# EAGLE design ltc3886circuit_rev1 (EAGLE 9.3.0)
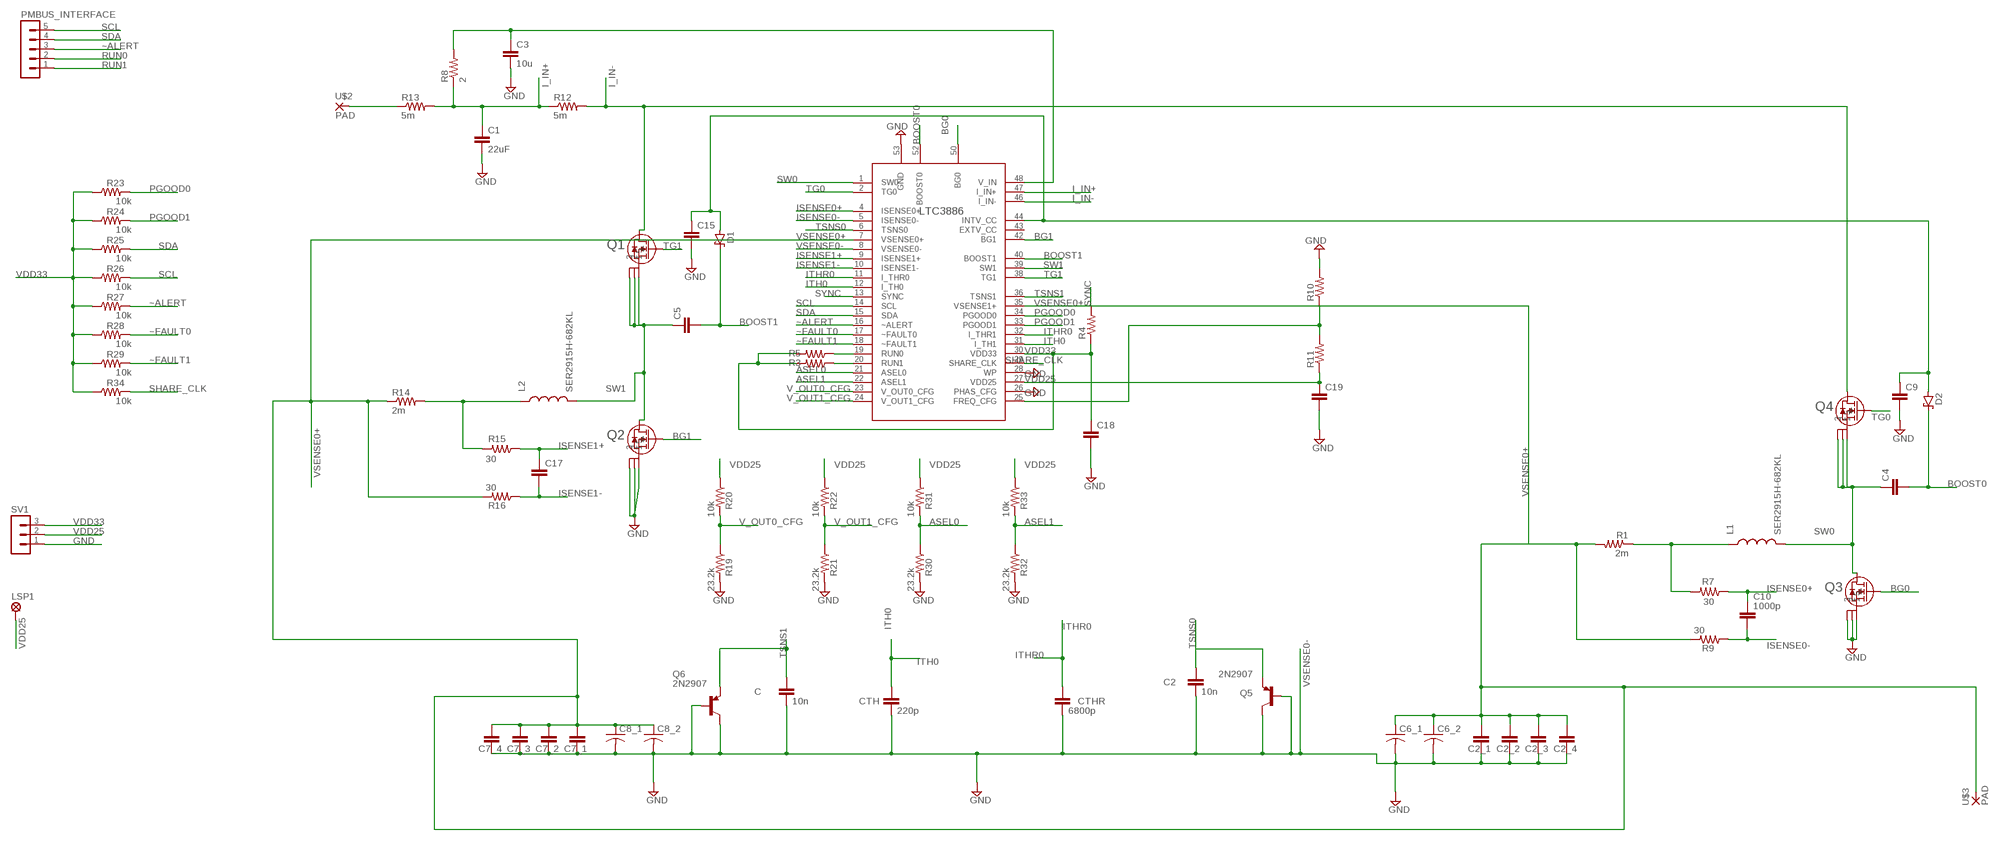
[diagram p0: schematic, sheet 1]

## Parts
C  10n  C-EU075-032X103  [C075-032X103]
C1  22uF  ESK226M100AE3AA(22UF_CAP)  [ESK226M100AE3AA(22UF_CAP)]
C2  10n  C-EU075-032X103  [C075-032X103]
C2_1  ESK226M100AE3AA(22UF_CAP)  [ESK226M100AE3AA(22UF_CAP)]
C2_2  ESK226M100AE3AA(22UF_CAP)  [ESK226M100AE3AA(22UF_CAP)]
C2_3  ESK226M100AE3AA(22UF_CAP)  [ESK226M100AE3AA(22UF_CAP)]
C2_4  ESK226M100AE3AA(22UF_CAP)  [ESK226M100AE3AA(22UF_CAP)]
C3  10u  C-EU075-032X103  [C075-032X103]
C4  C-EU075-032X103  [C075-032X103]
C5  C-EU075-032X103  [C075-032X103]
C6_1  C-US050-025X075  [C050-025X075]
C6_2  C-US050-025X075  [C050-025X075]
C7_1  ESK226M100AE3AA(22UF_CAP)  [ESK226M100AE3AA(22UF_CAP)]
C7_2  ESK226M100AE3AA(22UF_CAP)  [ESK226M100AE3AA(22UF_CAP)]
C7_3  ESK226M100AE3AA(22UF_CAP)  [ESK226M100AE3AA(22UF_CAP)]
C7_4  ESK226M100AE3AA(22UF_CAP)  [ESK226M100AE3AA(22UF_CAP)]
C8_1  C-US050-025X075  [C050-025X075]
C8_2  C-US050-025X075  [C050-025X075]
C9  C-EU075-032X103  [C075-032X103]
C10  1000p  C-EU075-032X103  [C075-032X103]
C15  C-EU075-032X103  [C075-032X103]
C17  C-EU075-032X103  [C075-032X103]
C18  C-EU075-032X103  [C075-032X103]
C19  C-EU075-032X103  [C075-032X103]
CTH  220p  C-EU075-032X103  [C075-032X103]
CTHR  6800p  C-EU075-032X103  [C075-032X103]
D1  SCHOTTKY-DIODECB417-15  [CB417-15]
D2  SCHOTTKY-DIODECB417-15  [CB417-15]
L1  SER2915H-682KL  [SER2915H-682KL]
L2  SER2915H-682KL  [SER2915H-682KL]
LSP1  MCS08  [MCS08]
PMBUS_INTERFACE  MA05-1  [MA05-1]
Q1  RJK0651DPB-00J5  [LFPAK]
Q2  RJK0651DPB-00J5  [LFPAK]
Q3  RJK0651DPB-00J5  [LFPAK]
Q4  RJK0651DPB-00J5  [LFPAK]
Q5  2N2907  [TO18]
Q6  2N2907  [TO18]
R1  2m  CSS2H-2512K-2L00FE  [CSS2H-2512K-2L00FE]
R3  R-US_0207/12  [0207/12]
R4  R-US_0207/12  [0207/12]
R5  R-US_0207/12  [0207/12]
R7  30  R-US_0207/12  [0207/12]
R8  2  ERJ-B1BF2R0U(2-OHM)  [ERJ-B1BF2R0U(2-OHM)]
R9  30  R-US_0207/12  [0207/12]
R10  R-US_0207/12  [0207/12]
R11  R-US_0207/12  [0207/12]
R12  5m  CSS4J-4026K-5L00F(5M-OHM)  [CSS4J-4026K-5L00F(5M-OHM)]
R13  5m  CSS2H-2512K-2L00FE  [CSS2H-2512K-2L00FE]
R14  2m  CSS2H-2512K-2L00FE  [CSS2H-2512K-2L00FE]
R15  30  R-US_0207/12  [0207/12]
R16  30  R-US_0207/12  [0207/12]
R19  23.2k  R-US_0207/12  [0207/12]
R20  10k  R-US_0207/12  [0207/12]
R21  23.2k  R-US_0207/12  [0207/12]
R22  10k  R-US_0207/12  [0207/12]
R23  10k  R-US_0207/12  [0207/12]
R24  10k  R-US_0207/12  [0207/12]
R25  10k  R-US_0207/12  [0207/12]
R26  10k  R-US_0207/12  [0207/12]
R27  10k  R-US_0207/12  [0207/12]
R28  10k  R-US_0207/12  [0207/12]
R29  10k  R-US_0207/12  [0207/12]
R30  23.2k  R-US_0207/12  [0207/12]
R31  10k  R-US_0207/12  [0207/12]
R32  23.2k  R-US_0207/12  [0207/12]
R33  10k  R-US_0207/12  [0207/12]
R34  10k  R-US_0207/12  [0207/12]
SV1  MA03-1  [MA03-1]
U$1  LTC3886  [QFN-52_UKG_2]
U$2  PAD  [PAD]
U$3  PAD  [PAD]

## Nets
ASEL0: R30.1 R31.2 U$1.21(ASEL0)
ASEL1: R32.1 R33.2 U$1.22(ASEL1)
BG0: Q3.4 U$1.50(BG0)
BG1: Q2.4 U$1.42(BG1)
BOOST0: C4.2 D2.C U$1.52(BOOST0)
BOOST1: C5.2 D1.C U$1.40(BOOST1)
GND: C1.P$2 C3.2 C9.2 C15.2 C18.2 C19.2 Q2.1 Q2.2 Q2.3 Q3.1 Q3.2 Q3.3 R10.2 R19.2 R21.2 R30.2 R32.2 SV1.1 U$1.26(PHAS_CFG) U$1.28(WP) U$1.53(GND)
I_IN+: C1.P$1 R8.P$1 R12.P$1 R13.P$2 U$1.47(I_IN+)
I_IN-: Q1.5 Q4.5 R12.P$2 U$1.46(I_IN-)
ISENSE0+: C10.1 R7.1 U$1.4(ISENSE0+)
ISENSE0-: C10.2 R9.1 U$1.5(ISENSE0-)
ISENSE1+: C17.1 R15.1 U$1.9(ISENSE1+)
ISENSE1-: C17.2 R16.1 U$1.10(ISENSE1-)
ITH0: CTH.1 U$1.12(I_TH0) U$1.31(I_TH1)
ITHR0: CTHR.1 U$1.11(I_THR0) U$1.32(I_THR1)
N$2: R5.1 U$1.19(RUN0)
N$3: R3.1 U$1.20(RUN1)
N$4: L2.P$1 R14.P$2 R15.2
N$5: C9.1 C15.1 D1.A D2.A U$1.44(INTV_CC)
N$8: L1.P$1 R1.P$1 R7.2
N$17: R13.P$1 U$2.P$1(P)
N$19: C3.1 R8.P$2 U$1.48(V_IN)
N$24: R10.1 R11.2 U$1.25(FREQ_CFG)
PGOOD0: R23.2 U$1.34(PGOOD0)
PGOOD1: R24.2 U$1.33(PGOOD1)
RUN0: PMBUS_INTERFACE.2
RUN1: PMBUS_INTERFACE.1
SCL: PMBUS_INTERFACE.5 R26.2 U$1.14(SCL)
SDA: PMBUS_INTERFACE.4 R25.2 U$1.15(SDA)
SHARE_CLK: R34.2 U$1.29(SHARE_CLK)
SW0: C4.1 L1.P$2 Q3.5 Q4.1 Q4.2 Q4.3 U$1.1(SW0)
SW1: C5.1 L2.P$2 Q1.1 Q1.2 Q1.3 Q2.5 U$1.39(SW1)
SYNC: R4.2 U$1.13(SYNC)
TG0: Q4.4 U$1.2(TG0)
TG1: Q1.4 U$1.38(TG1)
TSNS0: C2.1 Q5.1(E) U$1.6(TSNS0)
TSNS1: C.1 Q6.1(E) U$1.36(TSNS1)
V_OUT0_CFG: R19.1 R20.2 U$1.23(V_OUT0_CFG)
V_OUT1_CFG: R21.1 R22.2 U$1.24(V_OUT1_CFG)
VDD25: C19.1 LSP1.MP R11.1 R20.1 R22.1 R31.1 R33.1 SV1.2 U$1.27(VDD25)
VDD33: C18.1 R3.2 R4.1 R5.2 R23.1 R24.1 R25.1 R26.1 R27.1 R28.1 R29.1 R34.1 SV1.3 U$1.30(VDD33)
VSENSE0+: C2_1.P$1 C2_2.P$1 C2_3.P$1 C2_4.P$1 C6_1.1 C6_2.1 C7_1.P$1 C7_2.P$1 C7_3.P$1 C7_4.P$1 C8_1.1 C8_2.1 R1.P$2 R9.2 R14.P$1 R16.2 U$1.7(VSENSE0+) U$1.35(VSENSE1+) U$3.P$1(P)
VSENSE0-: C2.2 C2_1.P$2 C2_2.P$2 C2_3.P$2 C2_4.P$2 C6_1.2 C6_2.2 C7_1.P$2 C7_2.P$2 C7_3.P$2 C7_4.P$2 C8_1.2 C8_2.2 C.2 CTH.2 CTHR.2 Q5.2(B) Q5.3(C) Q6.2(B) Q6.3(C) U$1.8(VSENSE0-) ; supply symbol labelled GND
~ALERT: PMBUS_INTERFACE.3 R27.2 U$1.16(~ALERT)
~FAULT0: R28.2 U$1.17(~FAULT0)
~FAULT1: R29.2 U$1.18(~FAULT1)
Unconnected: U$1.43(EXTV_CC)

## Library data of the parts
C C2-C5 C9 C10 C15 C17-C19 CTH CTHR = rcl:C-EU: CAPACITOR, European symbol; SPICEPREFIX: C
C1 C2_1-C2_4 C7_1-C7_4 = power_subsystem_components:ESK226M100AE3AA(22UF_CAP)
C6_1 C6_2 C8_1 C8_2 = rcl:C-US: CAPACITOR, American symbol; SPICEPREFIX: C
D1 D2 = diode:SCHOTTKY-DIODE: Schottky Diode
L1 L2 = power_subsystem_components:SER2915H-682KL
LSP1 = solpad:MCS08: SOLDER PAD MC S0,8, drill 1.2 mm, distributor Buerklin, 08F130
PMBUS_INTERFACE = con-lstb:MA05-1: PIN HEADER; OC_FARNELL: unknown; OC_NEWARK: unknown
Q1-Q4 = SamacSys_Parts:RJK0651DPB-00J5; MANUFACTURER_PART_NUMBER: RJK0651DPB00#J5; VENDOR: Renesas Electronics
Q5 Q6 = transistor-pnp:2N2907*: PNP Transistor
R1 R13 R14 = power_subsystem_components:CSS2H-2512K-2L00FE
R3-R5 R7 R9-R11 R15 R16 R19-R34 = rcl:R-US_: RESISTOR, American symbol; SPICEPREFIX: R
R8 = power_subsystem_components:ERJ-B1BF2R0U(2-OHM)
R12 = power_subsystem_components:CSS4J-4026K-5L00F(5M-OHM)
SV1 = con-lstb:MA03-1: PIN HEADER; OC_FARNELL: unknown; OC_NEWARK: unknown
U$1 = ltc3886:LTC3886
U$2 U$3 = power_subsystem_components:PAD

## Board
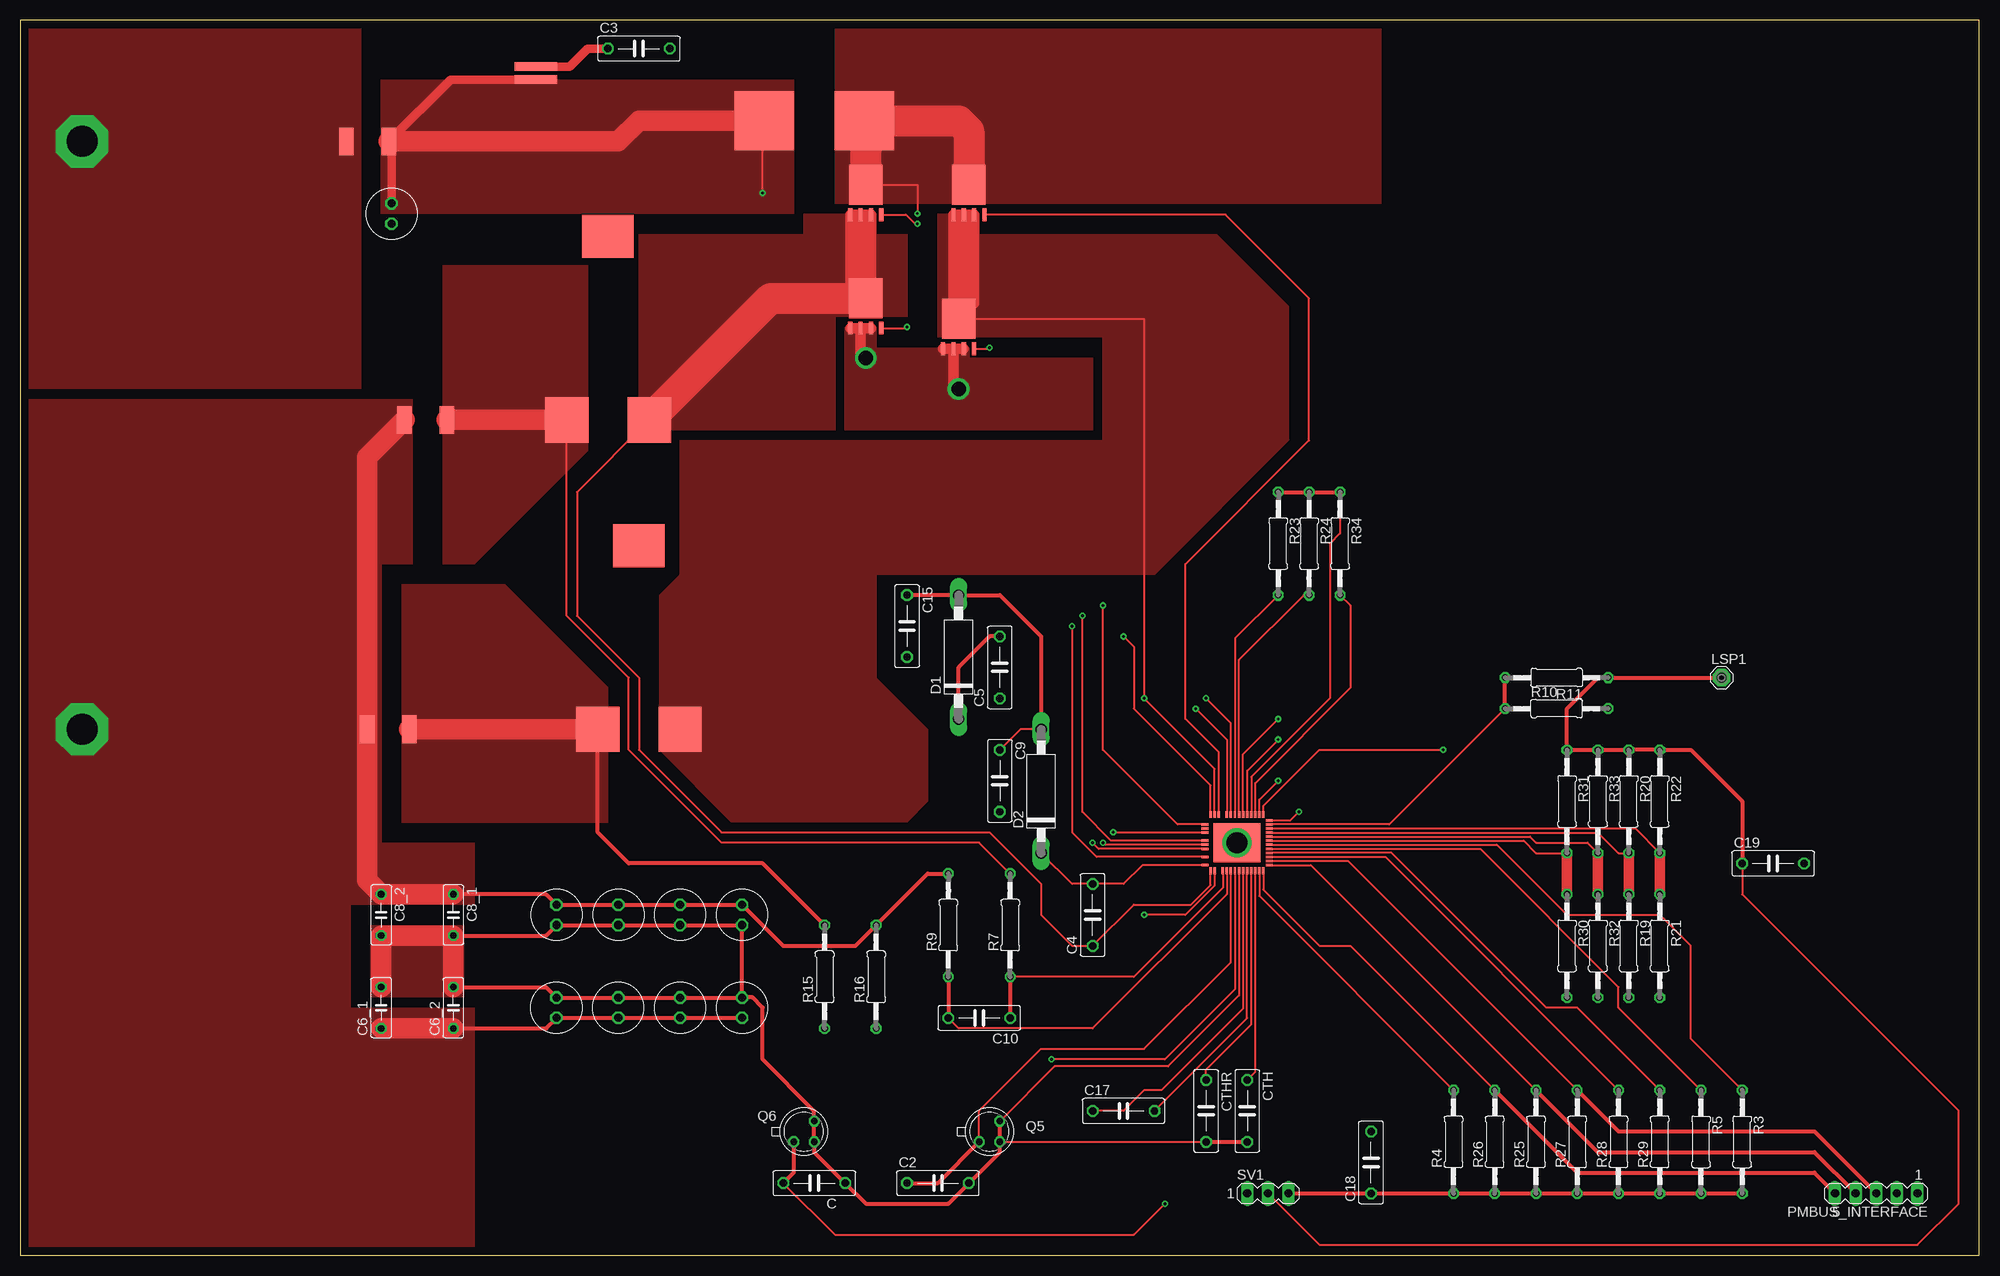
[diagram p1: board, top side]
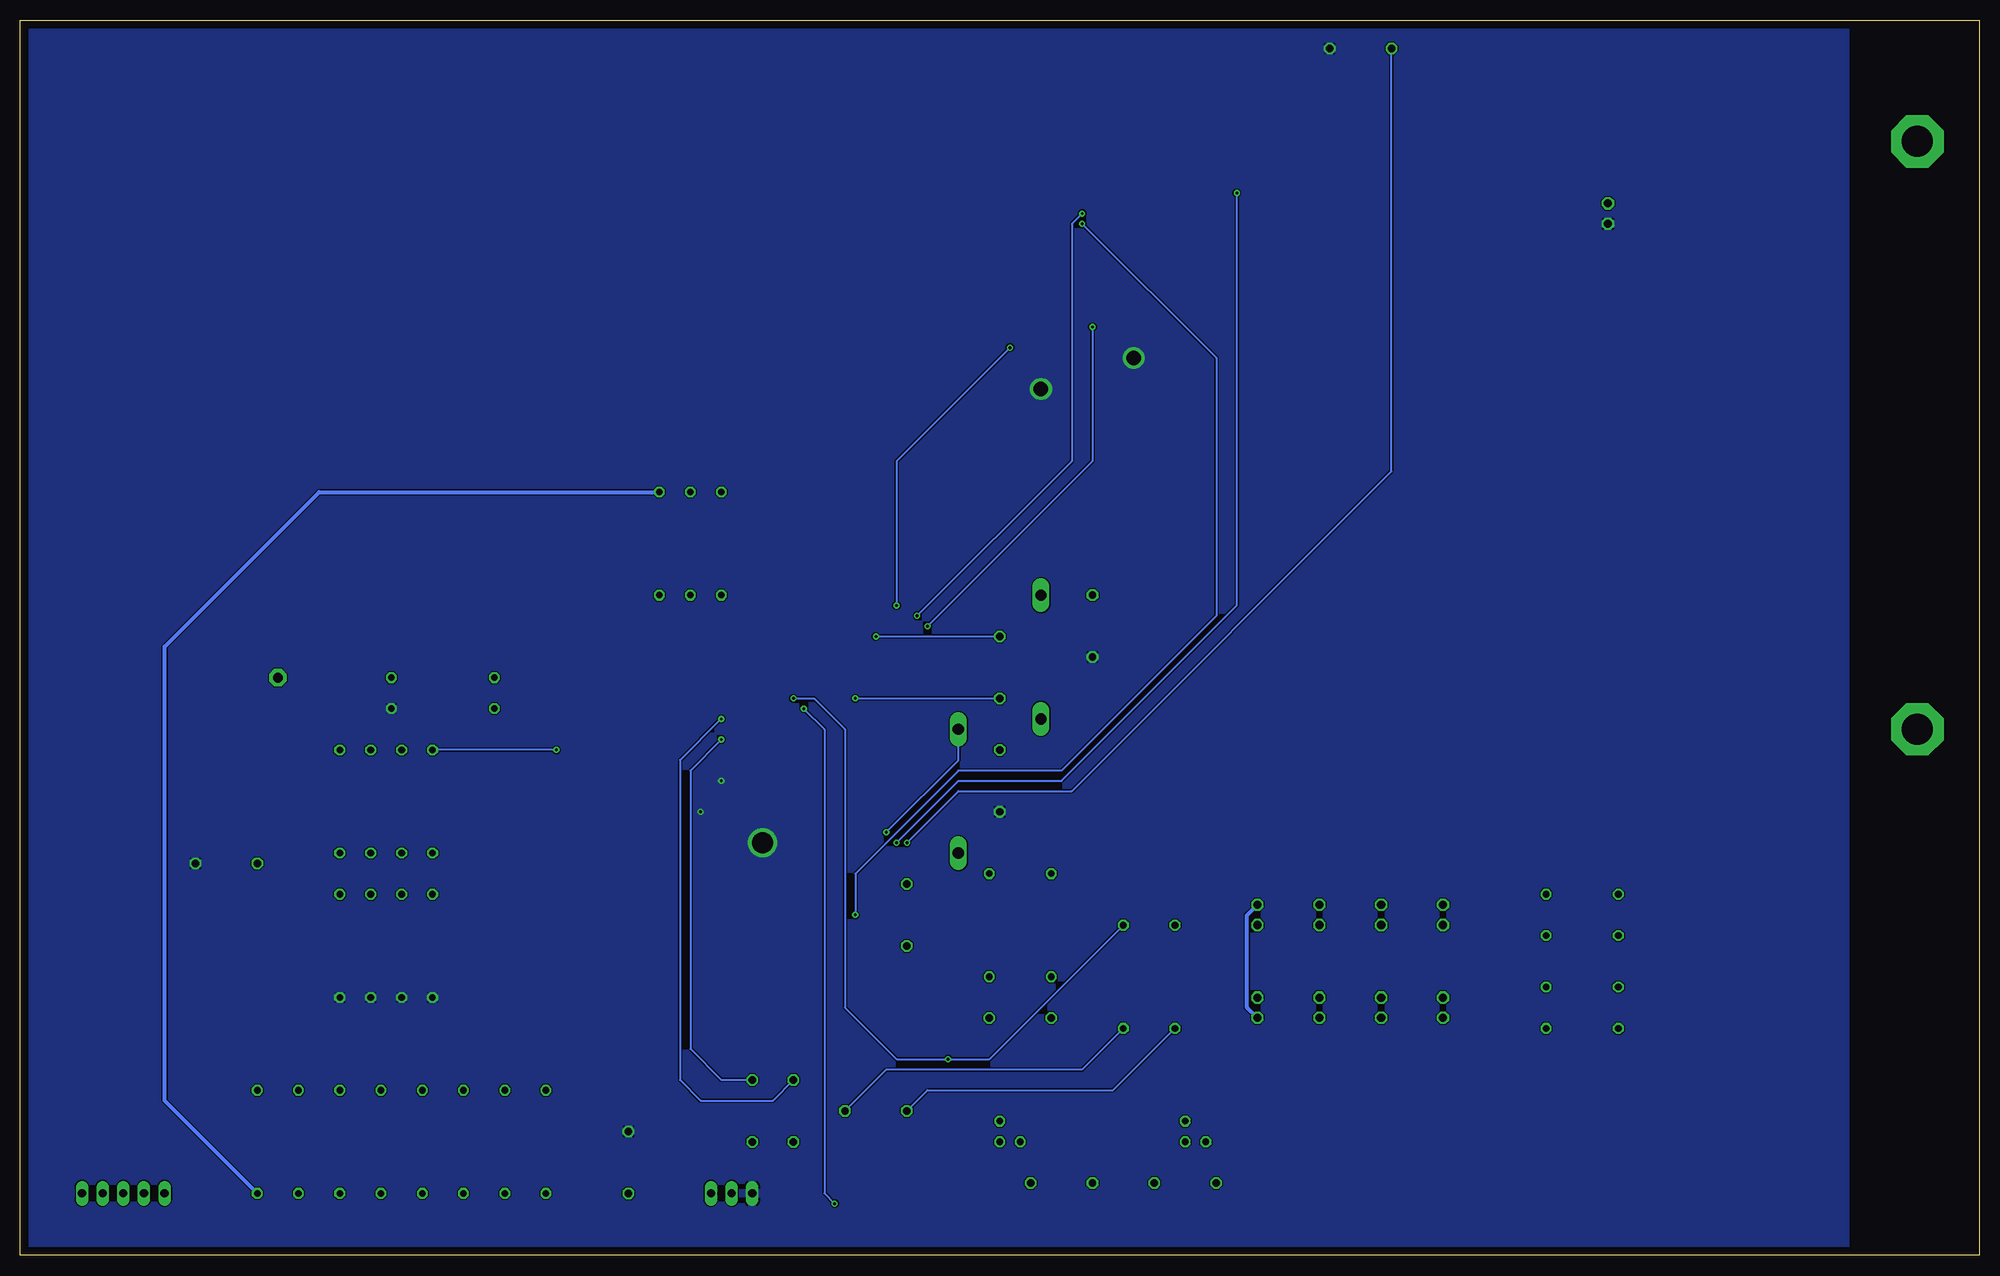
[diagram p2: board, bottom side, seen from below]

Size 241.28 x 152.07 mm. Coordinates in mm from the lower left corner, seen from the top.
Outline: 0,0 241.28,0 241.28,152.07 0,152.07 0,0
Copper layers (1*16): Top 0.035mm / dielectric 1.5mm / Bottom 0.035mm
Design rules "default": minimum track width 6mil, minimum drill 0.35mm, track to track 6mil, track to pad 6mil, pad to pad 6mil, via to via 6mil, smd to smd 6mil, copper to edge 40mil, drill to drill 6mil, minimum pad ring 10mil, minimum via ring 8mil, stop-mask expansion 4mil, vias tented up to drill 0mil, thermal gap 10mil

### Footprints (pad centres in the part's own frame; a part is rotated, then mirrored left to right if it is on the bottom)
C075-032X103 = drill 0.914 octagon: 1 -3.81,0; 2 3.81,0
ESK226M100AE3AA(22UF_CAP) = drill 1 octagon: P$1 -1.25,0; P$2 1.25,0
C050-025X075 = drill 0.813 octagon: 1 -2.54,0; 2 2.54,0
CB417-15 = drill 1.397 long: A 7.62,0; C -7.62,0
SER2915H-682KL = smd 5.33 x 5.59: P$1 -5.075,0; P$2 5.075,0 | smd 6.35 x 5.28: P$3 0,22.6
MCS08 = drill 1.194 pad 2.159 octagon: MP 0,0
MA05-1 = drill 1.016 long: 1 -5.08,0; 2 -2.54,0; 3 0,0; 4 2.54,0; 5 5.08,0
LFPAK = smd 1.549 x 0.508: 1 -2.68,1.905; 2 -2.68,0.635; 3 -2.68,-0.635; 4 -2.68,-1.905 | smd 4.902 x 4.14: 5 1.003,0
TO18 = drill 0.813 octagon: 1 -1.27,-1.27; 2 1.27,-1.27; 3 1.27,1.27
CSS2H-2512K-2L00FE = smd 1.8 x 3.4: P$1 -3,0; P$2 2.2,0
0207/12 = drill 0.813 octagon: 1 -6.35,0; 2 6.35,0
ERJ-B1BF2R0U(2-OHM) = smd 1.1 x 5.2: P$1 0,0; P$2 1.6,0
CSS4J-4026K-5L00F(5M-OHM) = smd 7.3 x 7.3: P$1 -6.15,0; P$2 6.15,0
MA03-1 = drill 1.016 long: 1 -2.54,0; 2 0,0; 3 2.54,0
QFN-52_UKG_2 = smd 0.813 x 0.305: 1 -3.454,3.25; 2 -3.454,2.75; 4 -3.454,1.75; 5 -3.454,1.25; 6 -3.454,0.75; 7 -3.454,0.25; 8 -3.454,-0.25; 9 -3.454,-0.75; 10 -3.454,-1.25; 11 -3.454,-1.75; 12 -3.454,-2.25; 13 -3.454,-2.75; 14 -3.454,-3.25; 27 3.454,-3.25; 28 3.454,-2.75; 29 3.454,-2.25; 30 3.454,-1.75; 31 3.454,-1.25; 32 3.454,-0.75; 33 3.454,-0.25; 34 3.454,0.25; 35 3.454,0.75; 36 3.454,1.25; 38 3.454,2.25; 39 3.454,2.75; 40 3.454,3.25 | smd 0.305 x 0.813: 15 -2.75,-3.95; 16 -2.25,-3.95; 17 -1.75,-3.95; 18 -1.25,-3.95; 19 -0.75,-3.95; 20 -0.25,-3.95; 21 0.25,-3.95; 22 0.75,-3.95; 23 1.25,-3.95; 24 1.75,-3.95; 25 2.25,-3.95; 26 2.75,-3.95; 42 2.25,3.95; 43 1.75,3.95; 44 1.25,3.95; 46 0.25,3.95; 47 -0.25,3.95; 48 -0.75,3.95; 50 -1.75,3.95; 52 -2.75,3.95 | smd 4.801 x 5.791: 53 0,0
PAD = drill 3.81 pad 6.452 octagon: P$1 0,0

### Placement (x,y rotation side)
C  97.79,8.89 0 top
C1  45.72,128.27 270 top
C2  113.03,8.89 0 top
C2_1  88.9,30.48 90 top
C2_2  81.28,30.48 90 top
C2_3  73.66,30.48 90 top
C2_4  66.04,30.48 90 top
C3  76.2,148.59 0 top
C4  132.08,41.91 90 top
C5  120.65,72.39 90 top
C6_1  44.45,30.48 90 top
C6_2  53.34,30.48 90 top
C7_1  66.04,41.91 270 top
C7_2  73.66,41.91 270 top
C7_3  81.28,41.91 270 top
C7_4  88.9,41.91 270 top
C8_1  53.34,41.91 270 top
C8_2  44.45,41.91 270 top
C9  120.65,58.42 270 top
C10  118.11,29.21 180 top
C15  109.22,77.47 270 top
C17  135.89,17.78 0 top
C18  166.37,11.43 90 top
C19  215.9,48.26 0 top
CTH  151.13,17.78 270 top
CTHR  146.05,17.78 270 top
D1  115.57,73.66 90 top
D2  125.73,57.15 90 top
L1  72.39,102.87 0 top
L2  76.2,64.77 0 top
LSP1  209.55,71.12 0 top
PMBUS_INTERFACE  228.6,7.62 180 top
Q1  116.84,130.81 90 top
Q2  115.57,114.3 90 top
Q3  104.14,116.84 90 top
Q4  104.14,130.81 90 top
Q5  119.38,15.24 0 top
Q6  96.52,15.24 0 top
R1  49.53,102.87 180 top
R3  212.09,13.97 270 top
R4  176.53,13.97 90 top
R5  207.01,13.97 270 top
R7  121.92,40.64 90 top
R8  63.5,144.78 90 top
R9  114.3,40.64 90 top
R10  189.23,67.31 0 top
R11  189.23,71.12 180 top
R12  97.79,139.7 0 top
R13  43.18,137.16 0 top
R14  45.72,64.77 0 top
R15  99.06,34.29 90 top
R16  105.41,34.29 90 top
R19  198.12,38.1 270 top
R20  198.12,55.88 270 top
R21  201.93,38.1 270 top
R22  201.93,55.88 270 top
R23  154.94,87.63 270 top
R24  158.75,87.63 270 top
R25  186.69,13.97 90 top
R26  181.61,13.97 90 top
R27  191.77,13.97 90 top
R28  196.85,13.97 90 top
R29  201.93,13.97 90 top
R30  190.5,38.1 270 top
R31  190.5,55.88 270 top
R32  194.31,38.1 270 top
R33  194.31,55.88 270 top
R34  162.56,87.63 270 top
SV1  153.67,7.62 0 top
U$1  149.86,50.8 90 top
U$2  7.62,137.16 0 top
U$3  7.62,64.77 0 top

### Tracks (layer width: path | path; a pad name or v marks a point on that pad's centre or on a via)
ASEL0
  Top 0.254: U$1.21 185.17,51.05 186.69,49.53 R31.2
  Top 1.27: R31.2 R30.1
ASEL1
  Top 0.254: R33.2 193.04,50.8 186.69,50.8 185.94,51.55 U$1.22
  Top 1.27: R33.2 R32.1
BG0  (via drill 0.35)
  Top 0.254: U$1.50 132.56,49.05 129.54,52.07 v129.54,77.47 | v109.22,114.3 109.08,114.16 Q3.4
  Bottom 0.254: v109.22,114.3 109.22,97.79 v129.54,77.47
BG1  (via drill 0.35)
  Top 0.254: U$1.42 142.53,53.05 133.35,62.23 v133.35,80.01 | v119.38,111.76 119.38,111.62 Q2.4
  Bottom 0.254: v133.35,80.01 133.35,97.79 v119.38,111.76
BOOST0
  Top 0.254: D2.C 129.54,45.72 C4.2 135.89,45.72 138.22,48.05 U$1.52
BOOST1  (via drill 0.35)
  Top 0.254: U$1.40 146.61,57.86 137.16,67.31 137.16,74.93 v135.89,76.2
  Top 0.508: C5.2 119.38,76.2 115.57,72.39 D1.C
  Bottom 0.254: v135.89,76.2 C5.2
GND  (via drill 0.35, 1.78, 2.54)
  Top 0.254: U$1.28 152.61,56.09 v154.94,58.42 | U$1.26 156.42,53.55 v157.48,54.61
  Top 1.27: Q2.1 Q2.2 | Q2.2 Q2.3 | Q3.1 Q3.2 | Q3.2 Q3.3 | Q2.2 114.94,107.31 v115.57,106.68 | Q3.2 103.5,111.12 v104.14,110.49
  other vias: 149.86,50.8
  pour Bottom: 16.51,158.75 259.08,158.75 259.08,-15.24 16.51,-15.24
  pour Top (no thermals): 101.6,114.3 105.41,114.3 105.41,111.76 116.84,111.76 116.84,110.49 132.08,110.49 132.08,101.6 101.6,101.6
I_IN+  (via drill 0.35)
  Top 0.254: U$1.47 133.6,50.55 v133.35,50.8 | v91.44,130.81 91.44,139.5 R12.P$1
  Top 1.016: R8.P$1 53,144.78 R13.P$2 45.71,136.83 C1.P$1
  Top 2.54: R13.P$2 73.66,137.16 76.2,139.7 R12.P$1
  Bottom 0.254: v133.35,50.8 125.73,58.42 113.03,58.42 91.44,80.01 v91.44,130.81
  pour Top (no thermals): 44.45,144.78 95.25,144.78 95.25,128.27 44.45,128.27
I_IN-  (via drill 0.35)
  Top 0.254: U$1.46 134.37,51.05 130.81,54.61 v130.81,78.74 | Q4.5 110.49,131.81 v110.49,128.27
  Top 3.81: Q1.5 116.84,138.43 115.57,139.7 R12.P$2 104.14,139.5 Q4.5
  Bottom 0.254: v130.81,78.74 111.76,97.79 111.76,127 v110.49,128.27
  pour Top (no thermals): 100.33,153.67 100.33,129.54 167.64,129.54 167.64,153.67
ISENSE0+
  Top 0.254: U$1.4 148.11,45.24 137.16,34.29 R7.1
  Top 0.508: R7.1 C10.1
ISENSE0-
  Top 0.254: U$1.5 148.61,44.47 132.08,27.94 115.57,27.94 C10.2
  Top 0.508: R9.1 C10.2
ISENSE1+
  Top 0.254: U$1.9 150.61,30.37 140.56,20.32 138.43,20.32 135.89,17.78 C17.1
  Bottom 0.254: C17.1 129.54,20.32 106.68,20.32 R15.1
ISENSE1-
  Top 0.254: C17.2 151.11,29.19 U$1.10
  Bottom 0.254: R16.1 110.49,22.86 134.62,22.86 C17.2
ITH0  (via drill 0.35)
  Top 0.254: CTH.1 152.11,22.57 U$1.12 | U$1.31 151.13,54.27 151.13,59.69 v154.94,63.5
  Bottom 0.254: v154.94,63.5 158.75,59.69 158.75,25.4 154.94,21.59 CTH.1
ITHR0  (via drill 0.35)
  Top 0.254: CTHR.1 146.05,22.86 151.61,28.42 U$1.11 | U$1.32 150.61,61.71 v154.94,66.04
  Bottom 0.254: v154.94,66.04 160.02,60.96 160.02,21.59 157.48,19.05 148.59,19.05 CTHR.1
N$2
  Top 0.254: U$1.19 179.82,50.05 196.85,33.02 196.85,30.48 R5.1
N$3
  Top 0.254: R3.1 205.74,26.67 205.74,38.1 201.93,41.91 190.5,41.91 181.86,50.55 U$1.20
N$4
  Top 0.508: R15.2 91.44,48.26 74.93,48.26 71.12,52.06 L2.P$1
  Top 2.54: L2.P$1 R14.P$2
  pour Top (no thermals): 46.99,82.55 46.99,53.34 72.39,53.34 72.39,69.85 59.69,82.55
N$5  (via drill 0.35)
  Top 0.254: U$1.44 134.64,52.05 v134.62,52.07 | D2.A 123.19,64.77 C9.1
  Top 0.508: C15.1 D1.A 120.65,81.28 125.73,76.2 D2.A
  Bottom 0.254: v134.62,52.07 125.73,60.96 D2.A
N$8
  Top 0.254: R7.2 118.11,50.8 86.36,50.8 74.93,62.23 74.93,71.12 67.31,78.73 L1.P$1
  Top 2.54: L1.P$1 R1.P$1
  pour Top (no thermals): 52.07,85.09 52.07,121.92 69.85,121.92 69.85,99.06 55.88,85.09
N$17
  pour Top (no thermals): -2.54,156.21 41.91,156.21 41.91,106.68 -2.54,106.68
N$19  (via drill 0.35)
  Top 0.254: U$1.48 132.83,50.05 v132.08,50.8
  Top 1.016: R8.P$2 67.64,146.38 69.85,148.59 C3.1
  Bottom 0.254: C3.1 72.39,96.52 111.76,57.15 125.73,57.15 v132.08,50.8
N$24
  Top 0.254: R10.1 168.62,53.05 U$1.25
  Top 0.508: R10.1 R11.2
PGOOD0
  Top 0.254: R23.2 149.61,75.95 U$1.34
PGOOD1
  Top 0.254: U$1.33 150.11,73.3 158.09,81.28 R24.2
SCL
  Top 0.254: U$1.14 153.11,45.01 160.02,38.1 163.83,38.1 R26.2
  Top 0.508: R26.2 191.77,10.16 220.98,10.16 PMBUS_INTERFACE.5
SDA
  Top 0.254: U$1.15 158.96,48.05 R25.2
  Top 0.508: R25.2 194.31,12.7 220.98,12.7 PMBUS_INTERFACE.4
SHARE_CLK
  Top 0.254: U$1.29 152.11,58.13 163.83,69.85 163.83,80.01 R34.2
SW0
  Top 0.254: U$1.1 146.61,45.59 144.21,43.18 137.16,43.18 C4.1 129.54,38.1 125.73,41.91 125.73,45.72 119.38,52.07 86.36,52.07 76.2,62.23 76.2,71.12 68.58,78.74 68.58,93.98 L1.P$2
  Top 1.27: Q4.2 Q4.1 102.24,119.75 Q3.5 | Q4.2 Q4.3 104.78,118.48 Q3.5 | Q4.2 103.5,118.48 Q3.5
  Top 3.81: L1.P$2 92.44,117.84 Q3.5
  pour Top (no thermals): 96.52,128.27 105.41,128.27 105.41,125.73 109.22,125.73 109.22,115.57 100.33,115.57 100.33,101.6 76.2,101.6 76.2,125.73 96.52,125.73
SW1  (via drill 0.35)
  Top 0.254: U$1.39 147.11,59.9 v138.43,68.58 138.43,115.3 Q2.5
  Top 1.27: Q1.2 Q1.1 114.94,116.2 116.21,114.94 Q1.2 | Q1.2 Q1.3 117.47,117.21 Q2.5
  Bottom 0.254: v138.43,68.58 C5.1
  pour Top (no thermals): 113.03,128.27 118.11,128.27 118.11,125.73 147.32,125.73 156.21,116.84 156.21,100.33 139.7,83.82 105.41,83.82 105.41,71.12 111.76,64.77 111.76,55.88 109.22,53.34 87.63,53.34 78.74,62.23 78.74,81.28 81.28,83.82 81.28,100.33 133.35,100.33 133.35,113.03 113.03,113.03
SYNC
  Top 0.254: U$1.13 152.61,44.24 R4.2
TG0  (via drill 0.35)
  Top 0.254: U$1.2 147.11,45.51 143.51,41.91 v138.43,41.91 | Q4.4 109.08,128.13 110.21,127 v110.49,127
  Bottom 0.254: v138.43,41.91 138.43,46.99 125.73,59.69 113.03,59.69 93.98,78.74 93.98,110.49 v110.49,127
TG1
  Top 0.254: U$1.38 147.61,61.94 143.51,66.04 143.51,85.09 158.75,100.33 158.75,117.83 148.45,128.13 Q1.4
TSNS0
  Top 0.254: Q5.1 118.11,17.78 125.73,25.4 138.43,25.4 149.11,36.08 U$1.6
  Top 0.508: Q5.1 113.03,8.89 C2.1
TSNS1  (via drill 0.35)
  Top 0.254: C.1 100.33,2.54 137.16,2.54 v140.97,6.35 | v144.78,67.31 148.61,63.48 U$1.36
  Top 0.508: Q6.1 95.25,10.16 C.1
  Bottom 0.254: v144.78,67.31 142.24,64.77 142.24,7.62 v140.97,6.35
V_OUT0_CFG
  Top 0.254: R20.2 196.85,49.53 194.33,52.05 U$1.23
  Top 1.27: R20.2 R19.1
V_OUT1_CFG
  Top 0.254: R22.2 198.91,52.55 U$1.24
  Top 1.27: R22.2 R21.1
VDD25  (via drill 0.35)
  Top 0.254: U$1.27 153.11,55.32 160.02,62.23 v175.26,62.23 | SV1.2 160.02,1.27 233.68,1.27 238.76,6.35 238.76,17.78 212.09,44.45 C19.1
  Top 0.508: C19.1 212.09,55.88 205.74,62.23 R22.1 R20.1 R33.1 R31.1 190.5,67.31 194.31,71.12 R11.1 LSP1.MP
  Bottom 0.254: v175.26,62.23 R31.1
VDD33
  Top 0.254: U$1.30 151.61,58.9 161.29,68.58 161.29,87.63 162.56,88.9 R34.1
  Top 0.508: R23.1 R24.1 R34.1 | SV1.3 C18.1 R4.1 R26.1 R25.1 R27.1 R28.1 R29.1 R5.2 R3.2
  Bottom 0.508: R3.2 223.52,19.05 223.52,74.93 204.47,93.98 R34.1
VSENSE0+  (via drill 0.35)
  Top 0.254: U$1.7 149.61,32.77 140.97,24.13 v127,24.13 | U$1.35 149.11,65.52 v146.05,68.58
  Top 0.508: C8_1.1 64.75,44.45 C7_1.P$1 C7_2.P$1 C7_3.P$1 C7_4.P$1 93.96,38.1 102.87,38.1 R16.2 111.76,46.99 R9.2 | C2_1.P$1 C2_2.P$1 C2_3.P$1 C2_4.P$1 66.04,29.21 64.77,27.94 C6_2.1
  Top 2.54: R1.P$2 42.72,98.26 R14.P$1 42.72,46.18 C8_2.1 C8_1.1 | C6_1.1 C6_2.1
  Bottom 0.254: R16.2 121.92,24.13 v127,24.13 133.35,24.13 139.7,30.48 139.7,64.77 143.51,68.58 v146.05,68.58
  Bottom 0.508: C2_1.P$1 90.17,30.5 90.17,41.91 90.15,41.91 C7_4.P$1
  pour Top (no thermals): 40.64,30.48 55.88,30.48 55.88,-2.54 -2.54,-2.54 -2.54,105.41 48.26,105.41 48.26,85.09 44.45,85.09 44.45,50.8 55.88,50.8 55.88,43.18 40.64,43.18
VSENSE0-
  Top 0.254: Q5.2 CTHR.2 | U$1.8 150.11,32 141.38,23.27 127.41,23.27 Q5.3
  Top 0.508: C8_1.2 64.75,39.37 C7_1.P$2 C7_2.P$2 C7_3.P$2 C7_4.P$2 88.9,31.75 | 88.9,31.75 C2_1.P$2 C2_2.P$2 C2_3.P$2 C2_4.P$2 64.75,33.02 C6_2.2 | 88.9,31.75 90.17,31.75 91.44,30.48 91.44,24.11 97.79,17.76 Q6.3 Q6.2 97.79,12.7 C.2 104.14,6.35 114.3,6.35 C2.2 120.65,12.7 Q5.2 Q5.3 | CTHR.2 CTH.2
  Top 2.54: C6_1.2 C8_2.2 C8_1.2 C6_2.2
  pour Top (no thermals): 43.18,40.64 54.61,40.64 54.61,31.75 43.18,31.75
~ALERT
  Top 0.254: U$1.16 163.54,48.55 R27.2
  Top 0.508: R27.2 196.85,15.24 220.98,15.24 PMBUS_INTERFACE.3
~FAULT0
  Top 0.254: U$1.17 168.12,49.05 R28.2
~FAULT1
  Top 0.254: R29.2 191.77,30.48 187.96,30.48 168.89,49.55 U$1.18